# EAGLE design EFR732 (EAGLE 9.0.0)
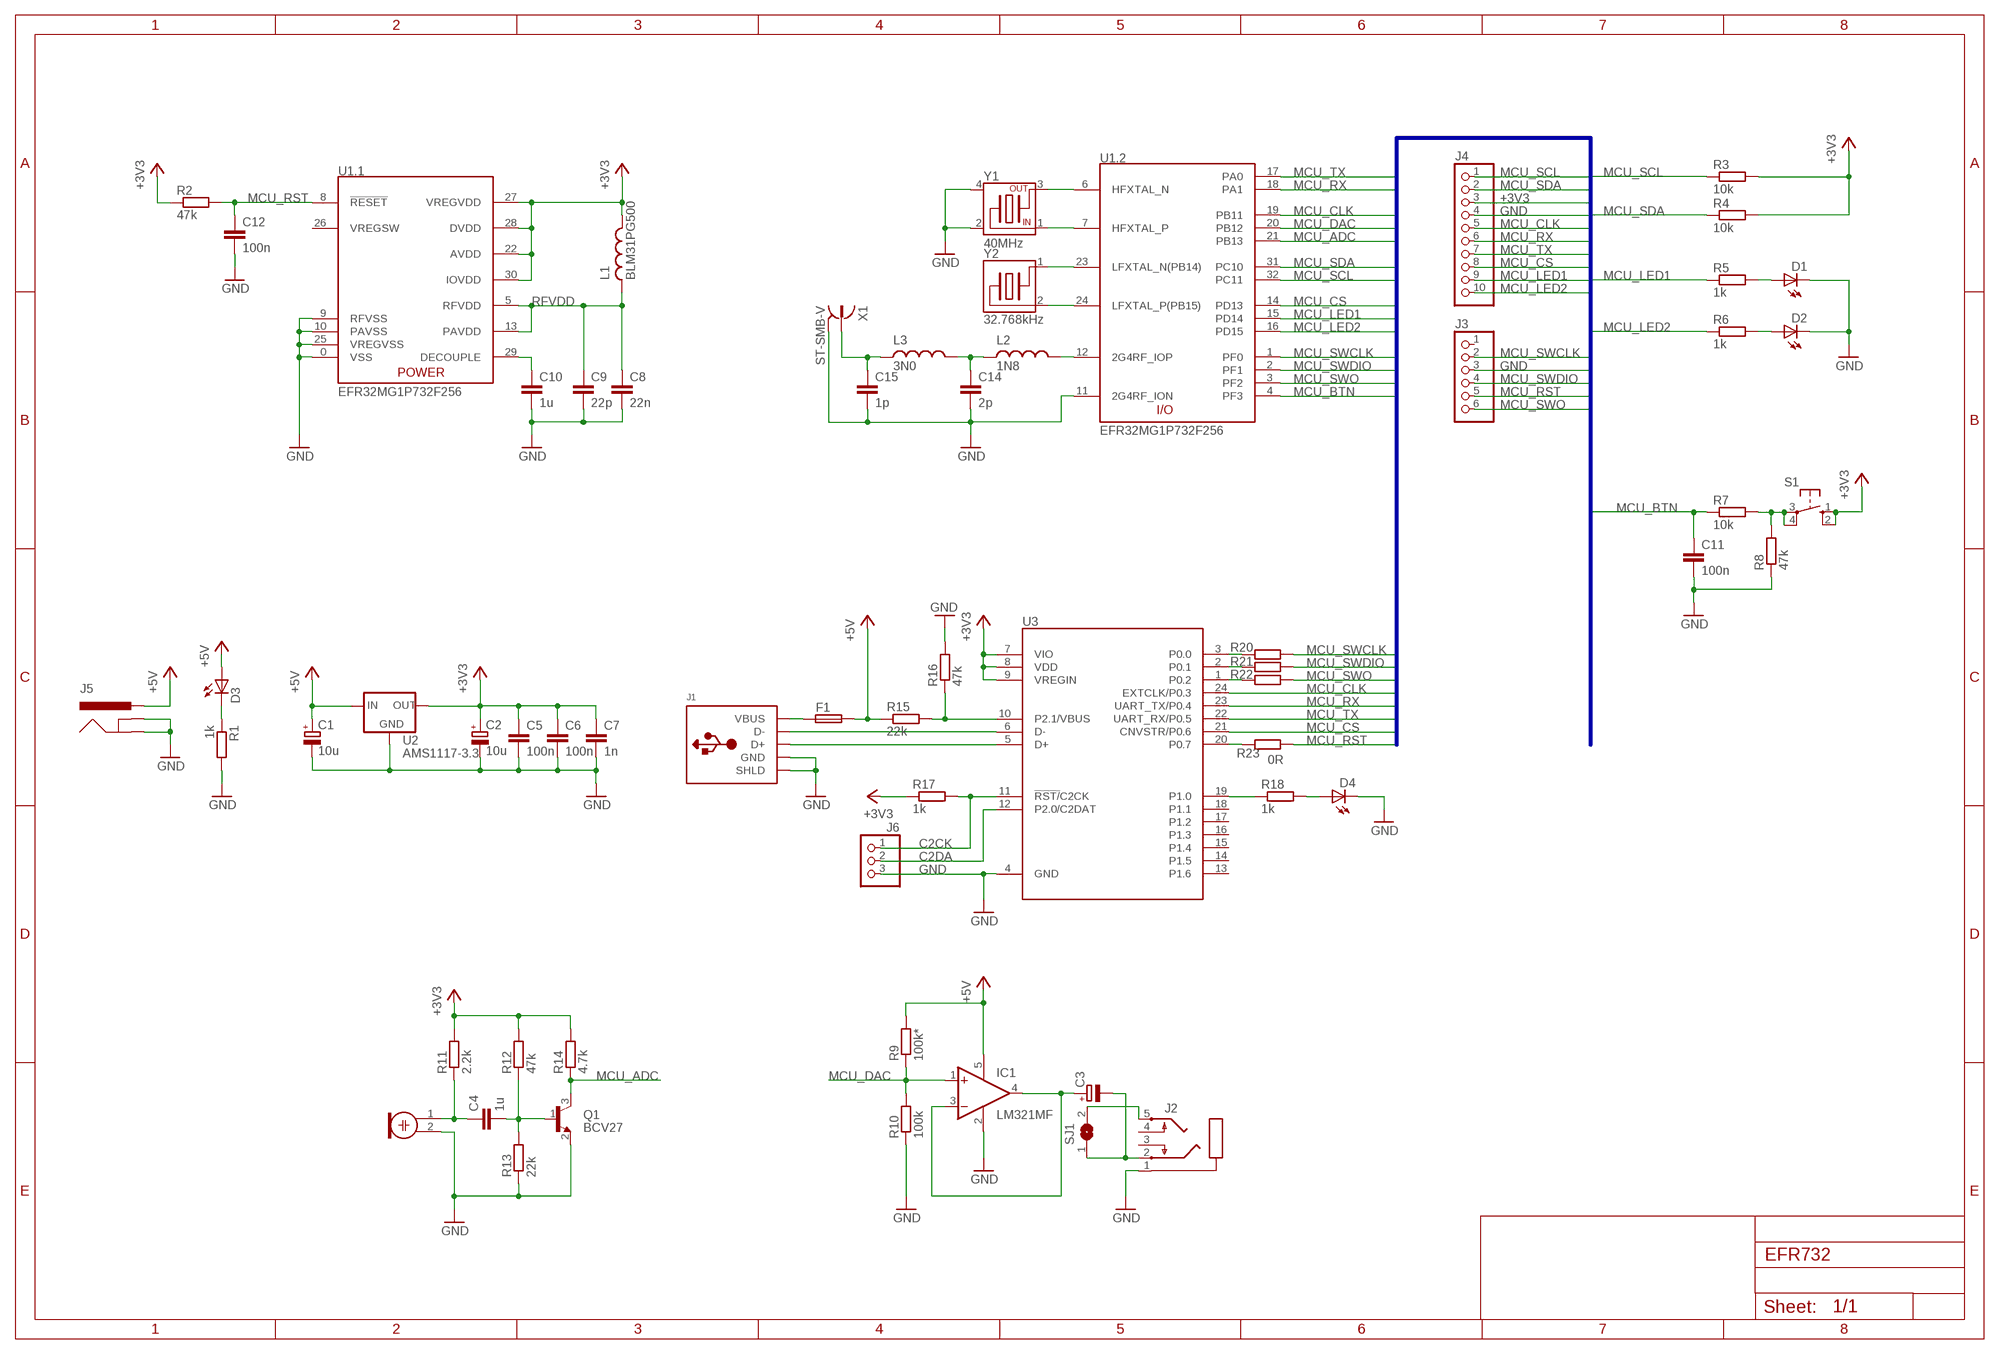
[diagram p0: schematic, sheet 1]

## Parts
C1  10u  CPOL-EU  [RCL-1206F-POL]
C2  10u  CPOL-EU  [RCL-1206F-POL]
C3  CPOL-EU  [RCL-1206F-POL]
C4  1u  C-EU1206  [RCL-1206F]
C5  100n  C-EU0805  [RCL-0805F]
C6  100n  C-EU0805  [RCL-0805F]
C7  1n  C-EU0805  [RCL-0805F]
C8  22n  C-EU0805  [RCL-0805F]
C9  22p  C-EU0805  [RCL-0805F]
C10  1u  C-EU1206  [RCL-1206F]
C11  100n  C-EU0805  [RCL-0805F]
C12  100n  C-EU0805  [RCL-0805F]
C14  2p  C-EU0805  [RCL-0805F]
C15  1p  C-EU0805  [RCL-0805F]
D1  LED1206  [LED-1206F]
D2  LED1206  [LED-1206F]
D3  LED1206  [LED-1206F]
D4  LED1206  [LED-1206F]
F1  FUSE-NSMF  [RCL-1206F]
IC1  LM321MF  [SOT23-5]
J1  USB-TYPE-B  [USB-TYPE-B-4P]
J2  AUDIO-JACK-3.5MM  [AUDIO-PG203J]
J3  PINH-1X06  [PINH-1X06]
J4  PINH-1X10  [PINH-1X10]
J5  POWER_JACK  [POWER_JACK_PTH]
J6  PINHD-1X3  [1X03]
L1  BLM31PG500  L-EU1206  [RCL-1206F]
L2  1N8  L-EU  [RCL-0603F]
L3  3N0  L-EU  [RCL-0603F]
M1  ELECTRET_MICROPHON-WM-62PC/62PK  [WM-62PC/62PK]
Q1  BCV27  TR-NPN  [SOT23]
R1  1k  R-EU0805  [RCL-0805F]
R2  47k  R-EU0805  [RCL-0805F]
R3  10k  R-EU0805  [RCL-0805F]
R4  10k  R-EU0805  [RCL-0805F]
R5  1k  R-EU0805  [RCL-0805F]
R6  1k  R-EU0805  [RCL-0805F]
R7  10k  R-EU0805  [RCL-0805F]
R8  47k  R-EU0805  [RCL-0805F]
R9  100k*  R-EU0805  [RCL-0805F]
R10  100k  R-EU0805  [RCL-0805F]
R11  2.2k  R-EU0805  [RCL-0805F]
R12  47k  R-EU0805  [RCL-0805F]
R13  22k  R-EU0805  [RCL-0805F]
R14  4.7k  R-EU0805  [RCL-0805F]
R15  22k  R-EU0805  [RCL-0805F]
R16  47k  R-EU0805  [RCL-0805F]
R17  1k  R-EU0805  [RCL-0805F]
R18  1k  R-EU0805  [RCL-0805F]
R20  R-EU0805  [RCL-0805F]
R21  R-EU0805  [RCL-0805F]
R22  R-EU0805  [RCL-0805F]
R23  0R  R-EU0805  [RCL-0805F]
S1  SWITCH-10-XX  [BUTTON-B3F-10XX]
SJ1  SJ  [SJ]
U1  EFR32MG1P732F256  EFR32MG1P732-QFN32  [QFN32_5X5MM_EFR32MG1]
U2  AMS1117-3.3  [SOT223]
U3  EFM8UB31F40G-QSOP24  [QSOP24-3.9X8.65MM]
X1  ST-SMB-V  [ST-SMB-V]
Y1  40MHz  CRYSTAL-FA-238R  [XTAL-FA-238]
Y2  32.768kHz  CRYSTAL-FC-135R  [XTAL-FC-135]

## Nets
+3V3: C2.+ C5.1 C6.1 C7.1 J4.3 L1.2 R2.1 R3.2 R4.2 R11.2 R12.2 R14.2 R17.1 S1.1(S) S1.2(S1) U1.22(.1:AVDD) U1.27(.1:VREGVDD) U1.28(.1:DVDD) U1.30(.1:IOVDD) U2.2(OUT) U2.4(OUT) U3.7(VIO) U3.8(VDD) U3.9(VREGIN)
+5V: C1.+ D3.A F1.2 IC1.5(V+) J5.PWR R9.2 R15.1 U2.3(IN)
C2CK: J6.1 R17.2 U3.11(!RST/!C2CK)
C2DA: J6.2 U3.12(P2.0/C2DAT)
GND: C1.- C2.- C5.2 C6.2 C7.2 C8.2 C9.2 C10.2 C11.2 C12.2 C14.2 C15.2 D1.C D2.C D4.C IC1.2(V-) J1.4_GND(GND) J1.M1(SHLD) J1.M2(SHLD) J2.1 J3.3 J4.4 J5.GND J5.GNDBREAK J6.3 M1.2 Q1.2(E) R1.2 R8.1 R10.1 R13.1 R16.2 U1.0(.1:VSS) U1.9(.1:RFVSS) U1.10(.1:PAVSS) U1.11(.2:2G4RF_ION) U1.25(.1:VREGVSS) U2.1(GND) U3.4(GND) X1.2 X1.3 X1.4 X1.5 Y1.2 Y1.4
MCU_ADC: Q1.3(C) R14.1 U1.21(.2:PB13)
MCU_BTN: C11.1 R7.1 U1.4(.2:PF3)
MCU_CLK: J4.5 U1.19(.2:PB11) U3.24(EXTCLK/P0.3)
MCU_CS: J4.8 U1.14(.2:PD13) U3.21(CNVSTR/P0.6)
MCU_DAC: IC1.1(+IN) R9.1 R10.2 U1.20(.2:PB12)
MCU_LED1: J4.9 R5.1 U1.15(.2:PD14)
MCU_LED2: J4.10 R6.1 U1.16(.2:PD15)
MCU_RST: C12.1 J3.5 R2.2 R23.2 U1.8(.1:!RESET)
MCU_RX: J4.6 U1.18(.2:PA1) U3.23(UART_TX/P0.4)
MCU_SCL: J4.1 R3.1 U1.32(.2:PC11)
MCU_SDA: J4.2 R4.1 U1.31(.2:PC10)
MCU_SWCLK: J3.2 R20.2 U1.1(.2:PF0)
MCU_SWDIO: J3.4 R21.2 U1.2(.2:PF1)
MCU_SWO: J3.6 R22.2 U1.3(.2:PF2)
MCU_TX: J4.7 U1.17(.2:PA0) U3.22(UART_RX/P0.5)
N$1: U1.23(.2:LFXTAL_N(PB14)) Y2.1(1.XIN)
N$2: U1.24(.2:LFXTAL_P(PB15)) Y2.2(2.XIN)
N$3: U1.7(.2:HFXTAL_P) Y1.1(X.IN)
N$4: U1.6(.2:HFXTAL_N) Y1.3(X.OUT)
N$5: F1.1 J1.1_VBUS(VBUS)
N$6: C14.1 L2.1 L3.2
N$7: R20.1 U3.3(P0.0)
N$8: C15.1 L3.1 X1.1
N$9: D3.C R1.1
N$10: D1.A R5.2
N$11: C10.1 U1.29(.1:DECOUPLE)
N$12: D2.A R6.2
N$13: C3.+ IC1.3(-IN) IC1.4(OUT)
N$14: J2.5 SJ1.2
N$15: R7.2 R8.2 S1.3(P) S1.4(P1)
N$16: J1.2_DM(D-) U3.6(D-)
N$17: J1.3_DP(D+) U3.5(D+)
N$18: R21.1 U3.2(P0.1)
N$19: R15.2 R16.1 U3.10(P2.1/VBUS)
N$20: C4.1 M1.1 R11.1
N$21: C3.- J2.2 SJ1.1
N$22: C4.2 Q1.1(B) R12.1 R13.2
N$23: R22.1 U3.1(P0.2)
N$24: R18.1 U3.19(P1.0)
N$25: D4.A R18.2
N$26: R23.1 U3.20(P0.7)
RF_IOP: L2.2 U1.12(.2:2G4RF_IOP)
RFVDD: C8.1 C9.1 L1.1 U1.5(.1:RFVDD) U1.13(.1:PAVDD)
Unconnected: J2.3 J2.4 J3.1 U3.13(P1.6) U3.14(P1.5) U3.15(P1.4) U3.16(P1.3) U3.17(P1.2) U3.18(P1.1)

## Buses
+3V3,GND,MCU_ADC,MCU_BTN,MCU_CLK,MCU_CS,MCU_DAC,MCU_LED1,MCU_LED2,MCU_RST,MCU_RX,MCU_SCL,MCU_SDA,MCU_SWCLK,MCU_SWDIO,MCU_SWO,MCU_TX

## Power pins joined to a net without a drawn wire
VREGSW: U1.26(.1:VREGSW)

## Library data of the parts
C1-C3 = MakBit:CPOL-EU: Polarized capacitor Tantalum SMD 3215, Electrolytic D: 5mm (10uF 50V), 6mm (100uF 9V), 7mm, 10mm (10uF 400V), 13mm (22uF 400V)
C4-C12 C14 C15 = MakBit:C-EU: SMD Capacitor
D1-D4 = MakBit:LED: LEDs Standard schematic elements and footprints for 5mm, 3mm, 1206 LEDs.
F1 = MakBit:FUSE-NSMF: Bourns MF-NSMF Series - PRC Resettable Fuses USB port protection - USB 2.0, 3.0 HDMI 1.4 Source protection PC motherboards - Plug and Play protection Mobile phones - Battery and port protection PDAs / digital cameras
IC1 = linear:LM321?*: Low Power Single Op Amp Source: http://cache.national.com/ds/LM/LM321.pdf
J1 = MakBit:USB-TYPE-B: USB Type-B Connector 4 Pins
J2 = MakBit:AUDIO-JACK-3.5MM: Audio Jack 3.5 mm (Stereo) Also known as: PG203J or ST-214N
J3 = MakBit:PINH-1X06
J4 = MakBit:PINH-1X10
J5 = MakBit:POWER_JACK: Power Jack DC For 5.5mm x 2.1mm connector. DS-210A, DCJ0202
J6 = pinhead:PINHD-1X3: PIN HEADER
L1-L3 = MakBit:L-EU: Inductor SMD 0603 0805 1206 Through hole 9 x 12 mm
M1 = microphon:ELECTRET_MICROPHON-: Electret Condenser Microphone
Q1 = MakBit:TR-NPN: Bipolar NPN transistor MMBT4401 SOT23 BC548 TO-92 MJE13007 TO-220
R1-R18 R20-R23 = MakBit:R-EU: SMD & Through-hole Resistor
S1 = MakBit:SWITCH-10-XX: OMRON SWITCH; MPN: B3F-1000; OC_FARNELL: 176432; OC_NEWARK: 36M3542
SJ1 = jumper:SJ: SMD solder JUMPER
U1 = MakBit:EFR32MG1P732-QFN32: EFR32MG1P732 Mighty Gecko SoC with Integrated Serial Flash This 5x5 QFN32 package is ideal for space constrained products that need to support ZigBee, Thread, BLE and proprietary networks. Integrates a 512 kB serial flash in the package to support over the air updates. High Performance 32-bit 40 MHz ARM Cortex®-M4 32 kB RAM, 256 kB flash program memory 2.4 GHz radio operation, TX power up to 19.5 dBm Bluetooth Smart, ZigBee®, Thread, 2.4 GHz Proprietary Protocols 12-bit ADC, iDAC, 16 GPIO, 12 channel PRS, USART/SPI/IrDA, I2C 2.3 to 3.6 V operation, 200 mA QFN32 5x5 mm Package
U2 = MakBit:AMS1117-3.3: 1A Low Dropout Voltage Regulator
U3 = silabs-mcu:EFM8UB31F40G-QSOP24: EFM8UB3 is a multi-purpose line of 8-bit microcontrollers with USB feature set insmall packages. <https://www.silabs.com/documents/public/data-sheets/efm8ub3-datasheet.pdf> CPU: 8051 48 MHz, 40 kB Flash, 3328 Bytes RAM Communication: UART, I2C, SPI, 12-bit ADC, 12-bit DAC, 3 PCA/PWM, 6 Timers, 17 I/O ports, 16-bit CRC Package: QSOP24 8.7x3.9 mm
X1 = con-coax:ST-SMB-V: MALE SMB CONNECTOR Radiall distributor RS 193-8855G7; OC_FARNELL: unknown; OC_NEWARK: unknown
Y1 = MakBit:CRYSTAL-FA-238R: FA-238 Crystal Unit Frequency range: 12 MHz to 60 MHz 3.2 x 2.5 mm
Y2 = MakBit:CRYSTAL-FC-135R

## Board
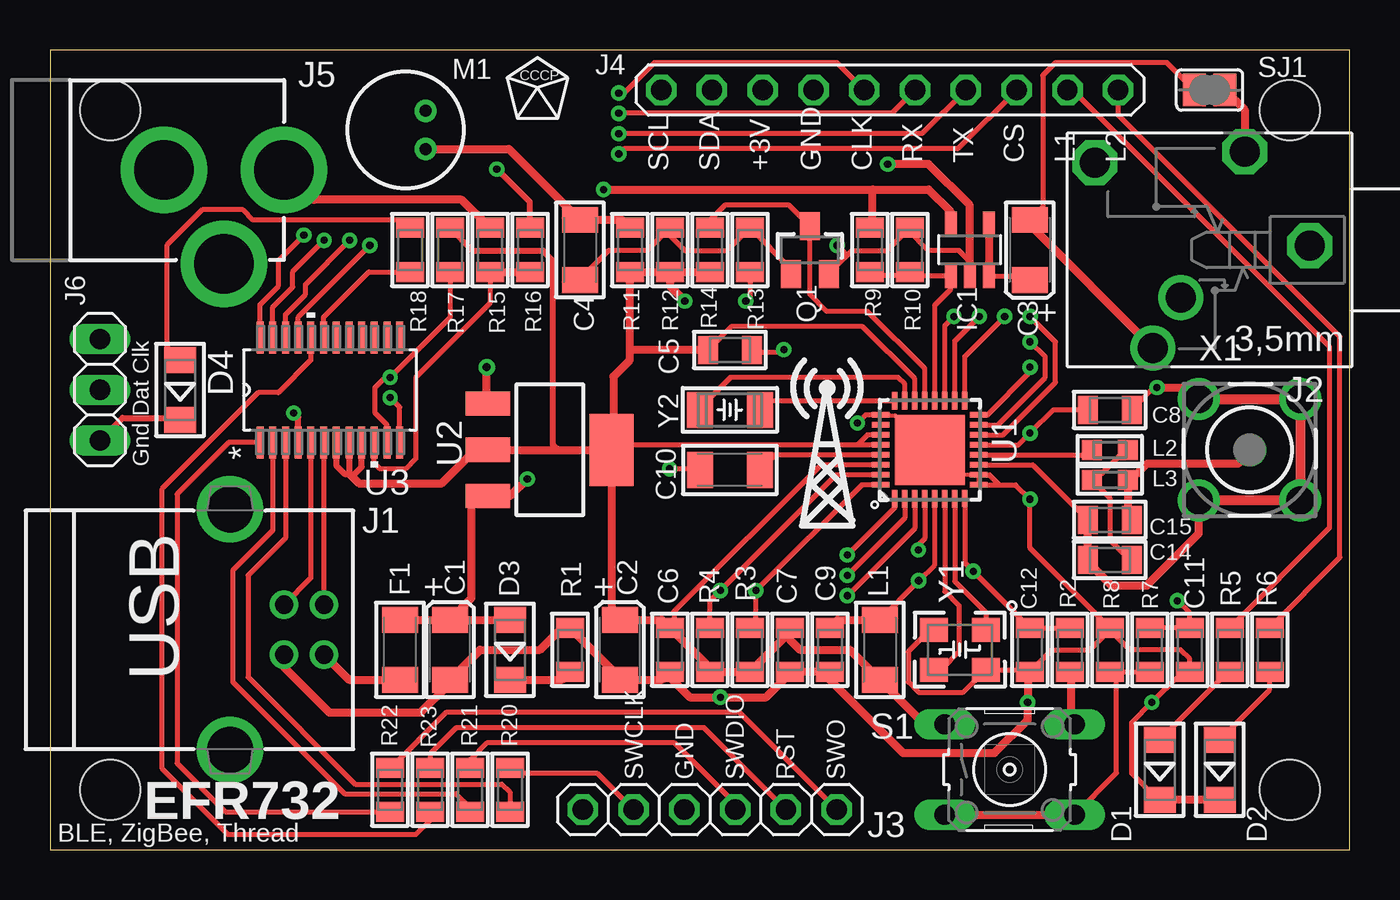
[diagram p1: board, top side]
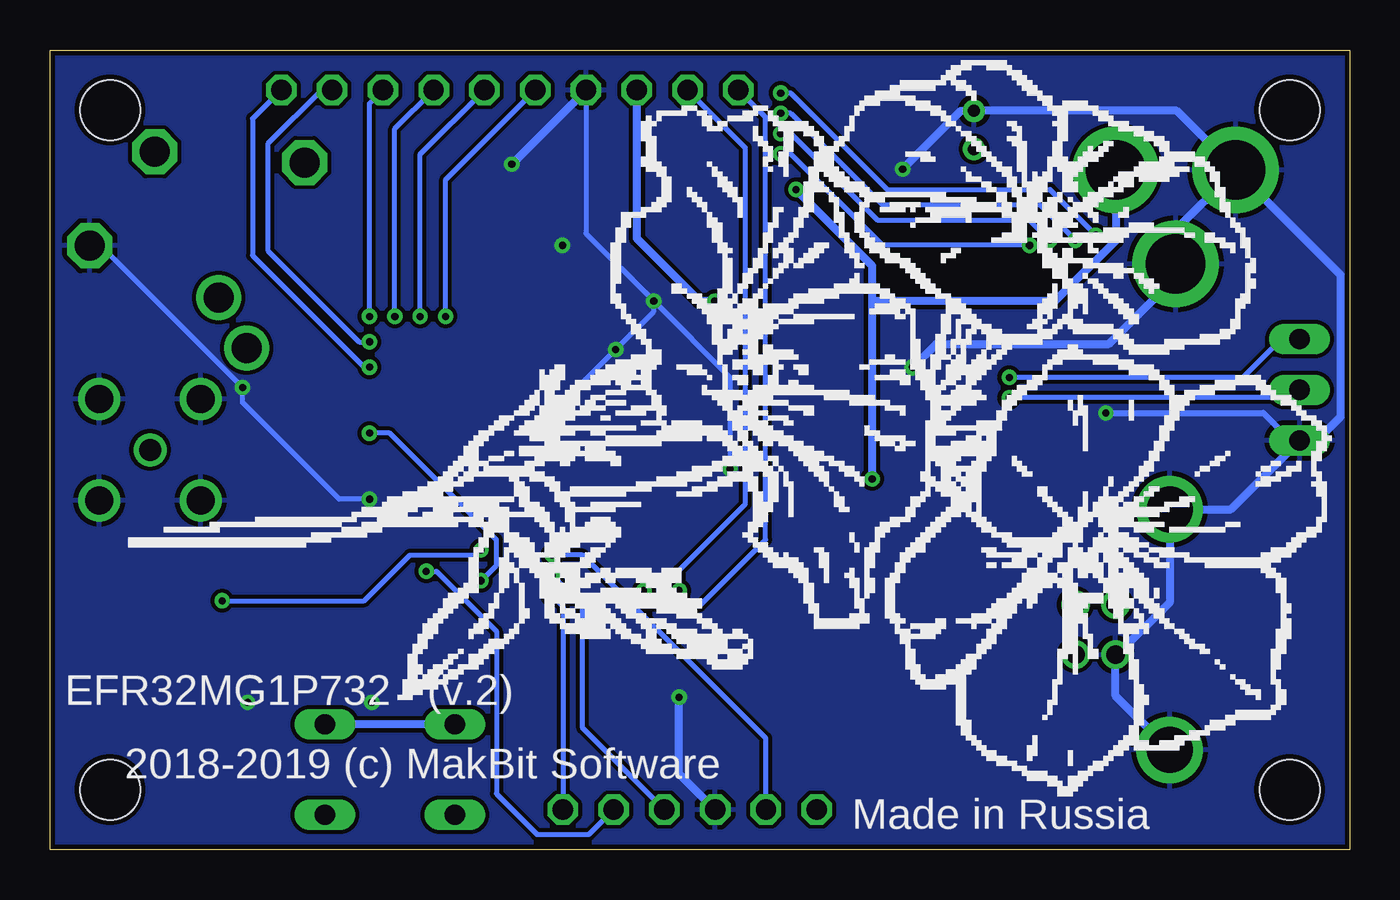
[diagram p2: board, bottom side, seen from below]

Size 65 x 40 mm. Coordinates in mm from the lower left corner, seen from the top.
Outline: 0,0 65,0 65,40 0,40 0,0
Copper layers (1*16): Top 0.035mm / dielectric 1.5mm / Bottom 0.035mm
Design rules "default *": minimum track width 10mil, minimum drill 14mil, track to track 8mil, track to pad 8mil, pad to pad 8mil, via to via 8mil, smd to smd 8mil, copper to edge 10mil, drill to drill 8mil, minimum pad ring 10mil, minimum via ring 8mil, stop-mask expansion 4mil, vias tented up to drill 16mil, thermal gap 10mil
Holes 3 mm at 3,3 3,37 62,37 62,3

### Footprints (pad centres in the part's own frame; a part is rotated, then mirrored left to right if it is on the bottom)
RCL-1206F-POL = smd 1.3 x 1.8: + 1.5,0; - -1.5,0
RCL-1206F = smd 1.3 x 1.8: 1 -1.5,0; 2 1.5,0
RCL-0805F = smd 1 x 1.4: 1 -1.1,0; 2 1.1,0
LED-1206F = smd 1.3 x 1.6: A -1.5,0; C 1.5,0
SOT23-5 = smd 0.6 x 1.2: 1 -0.95,-1.306; 2 0,-1.306; 3 0.95,-1.306; 4 0.95,1.306; 5 -0.95,1.306
USB-TYPE-B-4P = drill 0.92 pad 1.27: 1_VBUS 4.71,-1.25; 2_DM 4.71,1.25; 3_DP 2.71,1.25; 4_GND 2.71,-1.25 | drill 2.3 pad 3: M1 0,6.02; M2 0,-6.02
AUDIO-PG203J = drill 1.499 octagon: 1 -5.004,-0.203; 4 5.74,-4.369; 5 -1.753,-4.902 | drill 1.499: 2 2.845,4.902; 3 1.448,2.388
PINH-1X06 = drill 1.016 octagon: 1 -6.35,0; 2 -3.81,0; 3 -1.27,0; 4 1.27,0; 5 3.81,0; 6 6.35,0
PINH-1X10 = drill 1.016 octagon: 1 -11.43,0; 2 -8.89,0; 3 -6.35,0; 4 -3.81,0; 5 -1.27,0; 6 1.27,0; 7 3.81,0; 8 6.35,0; 9 8.89,0; 10 11.43,0
POWER_JACK_PTH = drill 2.997 pad 4.318: GND 0,7.7; GNDBREAK 4.7,10.7; PWR 0,13.7
1X03 = drill 1.016 long: 1 -2.54,0; 2 0,0; 3 2.54,0
RCL-0603F = smd 1 x 1: 1 -0.9,0; 2 0.9,0
WM-62PC/62PK = drill 0.6 pad 1: 1 -1,0.95; 2 -1,-0.95
SOT23 = smd 1 x 1.4: 1 -0.95,-1.2; 2 0.95,-1.2; 3 0,1.2
BUTTON-B3F-10XX = drill 1.016 long: 1 -3.251,2.261; 2 3.251,2.261; 3 -3.251,-2.261; 4 3.251,-2.261
SJ = smd 1.168 x 1.6: 1 -0.762,0; 2 0.762,0
QFN32_5X5MM_EFR32MG1 = smd 3.5 x 3.5: 0 0,0 | smd 0.86 x 0.26: 1 -2.45,1.75; 2 -2.45,1.25; 3 -2.45,0.75; 4 -2.45,0.25; 5 -2.45,-0.25; 6 -2.45,-0.75; 7 -2.45,-1.25; 8 -2.44,-1.75; 17 2.45,-1.75; 18 2.45,-1.25; 19 2.45,-0.75; 20 2.45,-0.25; 21 2.45,0.25; 22 2.45,0.75; 23 2.45,1.25; 24 2.45,1.75 | smd 0.26 x 0.86: 9 -1.75,-2.45; 10 -1.25,-2.45; 11 -0.75,-2.45; 12 -0.25,-2.45; 13 0.25,-2.45; 14 0.75,-2.45; 15 1.25,-2.45; 16 1.75,-2.45; 25 1.75,2.45; 26 1.25,2.45; 27 0.75,2.45; 28 0.25,2.45; 29 -0.25,2.45; 30 -0.75,2.45; 31 -1.25,2.45; 32 -1.75,2.45
SOT223 = smd 1.219 x 2.235: 1 -2.311,-3.099; 2 0,-3.099; 3 2.311,-3.099 | smd 3.6 x 2.2: 4 0,3.099
QSOP24-3.9X8.65MM = smd 1.6 x 0.35: 1 -2.625,3.493; 2 -2.625,2.857; 3 -2.625,2.223; 4 -2.625,1.587; 5 -2.625,0.953; 6 -2.625,0.318; 7 -2.625,-0.318; 8 -2.625,-0.953; 9 -2.625,-1.587; 10 -2.625,-2.223; 11 -2.625,-2.857; 12 -2.625,-3.493; 13 2.625,-3.493; 14 2.625,-2.857; 15 2.625,-2.223; 16 2.625,-1.587; 17 2.625,-0.953; 18 2.625,-0.318; 19 2.625,0.318; 20 2.625,0.953; 21 2.625,1.587; 22 2.625,2.223; 23 2.625,2.857; 24 2.625,3.493
ST-SMB-V = drill 1.1: 1 0,0 | drill 1.4: 2 -2.54,2.54; 3 2.54,2.54; 4 2.54,-2.54; 5 -2.54,-2.54
XTAL-FA-238 = smd 1.4 x 1.2: 1 -1.3,-1; 2 1.3,-1; 3 1.3,1; 4 -1.3,1
XTAL-FC-135 = smd 1.3 x 1.8: 1 -1.5,0; 2 1.5,0

### Placement (x,y rotation side)
C1  20,10 90 top
C2  28.5,10 90 top
C3  49,30 270 top
C4  26.5,30 270 top
C5  34,25 0 top
C6  31,10 270 top
C7  37,10 270 top
C8  53,22 0 top
C9  39,10 270 top
C10  34,19 180 top
C11  57,10 270 top
C12  49,10 270 top
C14  53,14.5 180 top
C15  53,16.5 180 top
D1  55.5,4 270 top
D2  58.5,4 270 top
D3  23,10 270 top
D4  6.5,23 270 top
F1  17.5,10 90 top
IC1  46,30 0 top
J1  9,11 0 top
J2  58,30 180 top
J3  33,2 0 top
J4  42,38 0 top
J5  -2,34 270 top
J6  2.5,23 270 top
L1  41.5,10 270 top
L2  53,20 180 top
L3  53,18.5 180 top
M1  17.78,36 180 top
Q1  38,30 0 top
R1  26,10 90 top
R2  51,10 90 top
R3  35,10 270 top
R4  33,10 270 top
R5  59,10 270 top
R6  61,10 270 top
R7  55,10 270 top
R8  53,10 270 top
R9  41,30 90 top
R10  43,30 270 top
R11  29,30 270 top
R12  31,30 270 top
R13  35,30 90 top
R14  33,30 270 top
R15  22,30 270 top
R16  24,30 90 top
R17  20,30 270 top
R18  18,30 90 top
R20  23,3 90 top
R21  21,3 90 top
R22  17,3 90 top
R23  19,3 90 top
S1  48,4 0 top
SJ1  58,38 0 top
U1  44,20 90 top
U2  25,20 270 top
U3  14,23 90 top
X1  60,20 0 top
Y1  45.5,10 180 top
Y2  34,22 0 top

### Tracks (layer width: path | path; a pad name or v marks a point on that pad's centre or on a via)
+3V3  (via drill 0.36)
  Top 0.254: U1.28 40.39,20.25 | 40.39,20.25 28.35,20.25 28.18,20.08 U2.4 | U1.27 40.89,20.75 40.39,20.25 | 31.21,10.89 31.21,11.91 38.55,19.25 U1.30 | U1.22 43.25,23.55 40.64,26.16 34.06,26.16 C5.1
  Top 0.305: R17.1 21.13,29.97 24.64,29.97 25.15,29.46 25.15,20.25 25.4,20 | U3.7 14.32,19.21 14.73,18.8 14.99,18.8 | 14.99,18.8 15.24,18.8 15.59,19.14 U3.9 | U3.8 14.95,18.83 14.99,18.8
  Top 0.406: S1.2 51.05,6.26 51.05,8.85 R2.1 | S1.1 43.74,6.26 L1.2 40,10 37.5,10 37,10.5 C7.1 37,10.9 R3.2 R4.2 33,9.1 31.21,10.89 C6.1 30.6,11.5 C2.+ 28.1,11.9 U2.4 25.4,20 U2.2 | 28.18,20.08 28.18,23.67 29,24.49 29,24.89 | 29,24.89 R11.2 R12.2 | R12.2 R14.2 | C5.1 29.11,25 29,24.89 | R12.2 31,28.18 v31.75,27.43 | U2.2 21.51,19.61 | U2.2 21.27,20 19.56,18.29 15.49,18.29 14.99,18.8
  Bottom 0.406: S1.1 S1.2 | v31.75,27.43 32.51,27.43 35.65,30.57 J4.3
+5V  (via drill 0.36)
  Top 0.254: 40.89,31.21 R9.2
  Top 0.406: C1.+ D3.A | C1.+ 21.08,12.58 21.08,17.53 21.25,17.69 U2.3 | U2.3 21.17,17.69 | v27.69,33.02 41.15,33.02 | 41.15,33.02 43.94,33.02 45.05,31.91 IC1.5 | R9.2 41.15,31.25 41.15,33.02 | F1.2 C1.+ | v23.88,18.54 23.02,17.69 U2.3 | R15.1 20.59,32.51 13.19,32.51 J5.PWR
  Bottom 0.406: v27.69,33.02 23.88,29.21 23.88,27.43 | 23.88,27.43 v23.88,18.54 | J5.PWR 11.7,30.46 14.73,27.43 23.88,27.43
C2CK  (via drill 0.36)
  Top 0.254: R17.2 20,26.6 v17.02,23.62 16.76,23.62 16.26,23.11 16.26,21.84 16.86,21.24 U3.11
  Bottom 0.254: 2.91,25.54 J6.1 3.42,25.54 5.33,23.62 v17.02,23.62
C2DA  (via drill 0.36)
  Top 0.254: v17.02,22.61 17.49,22.13 U3.12
  Bottom 0.254: J6.2 2.89,22.61 v17.02,22.61
GND  (via drill 0.36, 0.41)
  Top 0.203: U1.25 41.96,21.75 41.99,21.71 42.28,21.71 U1.0 45.25,18.75 U1.10 U1.9
  Top 0.254: 53,11 52,10 50.1,10 C12.2 48.9,9 Y1.4 45.67,7.87 43.43,7.87 42.93,8.38 42.93,9.91 44.02,11 Y1.2 | 53,11 R8.1 49.02,15.08 v49.02,17.53 48.3,18.25 47.5,18.25 | 53,11 54,10 56.55,10 57,9.55 C11.2 56.65,8.9 56.03,8.28 56.03,8.26 55.84,8.07 55.82,8.07 v55.12,7.37 54.1,6.35 54.1,3.81 55.41,2.5 D1.C | Q1.2 39.75,29.6 | 39.75,29.6 40.12,29.97 41.87,29.97 42.91,31.01 | 42.91,31.01 R10.1 | IC1.2 45.97,28.72 45.97,29.46 45.47,29.97 43.94,29.97 42.91,31.01 | U1.25 40.8,21.75 v40.39,21.34 | C10.2 32.45,19.05 v30.99,19.05 | R13.1 35,27.63 v34.8,27.43 | C5.2 35.21,24.89 36.58,24.89 v36.7,25.02 | C8.2 55.21,23.11 v55.37,23.11 | U1.9 47.5,18.25 | 48.9,7.62 v48.9,7.37 | U1.10 47,18.75 47.5,18.25 | U1.11 49.15,19.25 C15.2 | 39.75,29.6 39.75,29.85 v39.37,30.23
  Top 0.305: R16.2 24,32.39 v22.35,34.04 | 6.84,21.84 6.6,21.6 | 6.6,21.6 D4.C | J6.3 3.64,21.6 6.6,21.6 | U3.4 12.41,21.62 v12.19,21.84
  Top 0.406: 37.08,8.9 C9.2 39,8.5 42.67,4.83 47.24,4.83 48.9,6.48 v48.9,7.37 | 37.08,8.9 C7.2 | 37.08,8.9 37.08,8.89 35.81,7.62 v33.53,7.62 32,7.62 31,8.62 C6.2 30.6,8.5 C2.- 28.5,8.6 R1.2 25.6,11.1 24.5,10 21.5,10 C1.- 20,8.32 18.54,6.86 13.97,6.86 11.71,9.12 J1.4_GND | U2.1 21.84,22.37 v21.84,24.13 | 48.9,9 48.9,7.62 | D2.C D1.C | IC1.2 46,32.23 43.94,34.29 v41.9,34.29 | X1.5 57.46,15.8 54.86,13.21 53.09,13.21 51.9,14.39 C14.2 C15.2 | v55.37,23.11 56.89,23.11 X1.2
  Top 0.508: X1.2 X1.3 X1.4 X1.5
  Bottom 0.254: v34.8,27.43 30.99,23.62 v30.99,19.05 | v40.39,21.34 v36.7,25.02 34.8,26.92 v34.8,27.43 | J2.1 62.46,30.2 v55.37,23.11 55.37,22.35 50.55,17.53 v49.02,17.53 | J4.4 38.19,30.82 v34.8,27.43 | J5.GNDBREAK 8.73,29.3 8.89,29.46
  Bottom 0.305: v12.19,21.84 4.32,21.84 2.72,20.24
  Bottom 0.406: v21.84,24.13 20.67,25.3 12.04,25.3 8.89,28.45 8.89,29.46 8.89,30.81 J5.GND | J1.M2 11.71,7.69 11.71,9.65 | 11.71,9.65 J1.4_GND | 11.71,9.65 9,12.36 J1.M1 5.94,17.02 2.72,20.24 J6.3 1.92,20.46 1.78,20.32 0.46,21.64 0.46,28.76 J5.GND | J4.4 v41.9,34.29 | J5.GND 8.65,36.95 M1.2 19.44,36.95 v22.35,34.04 | J3.3 33.53,3.8 v33.53,7.62
  pour Bottom: 0.02,39.88 0.02,0 65.02,0 65.02,39.88
MCU_ADC
  Top 0.254: R14.1 33,31.48 33.78,32.26 36.94,32.26 Q1.3 38,27.79 38.86,26.92 40.89,26.92 43.75,24.07 U1.21
MCU_BTN  (via drill 0.36)
  Top 0.254: R7.1 C11.1 57,11.83 v56.39,12.45 | v43.43,14.99 43.43,15.24 43.75,15.56 U1.4
  Bottom 0.254: v56.39,12.45 49.28,12.45 46.99,14.73 43.69,14.73 v43.43,14.99
MCU_CLK  (via drill 0.36)
  Top 0.254: U1.19 44.75,26.21 v45.21,26.67 | J4.5 39.36,39.37 30.23,39.37 28.7,37.85 v28.45,37.85 | U3.24 10.51,27.27 11.43,28.19 11.43,29.46 v12.7,30.73
  Bottom 0.254: v45.21,26.67 45.21,33.52 J4.5 | v28.45,37.85 27.94,37.85 23.11,33.02 14.99,33.02 v12.7,30.73
MCU_CS  (via drill 0.36)
  Top 0.254: U1.14 47.67,20.75 50.29,23.37 50.29,25.4 v49.02,26.67 | v28.45,34.8 28.7,35.05 45.4,35.05 J4.8 | U3.21 12.41,26.64 v16,30.23
  Bottom 0.254: v49.02,26.67 49.02,37.33 J4.8 | v16,30.23 23.37,30.23 27.94,34.8 v28.45,34.8
MCU_DAC
  Top 0.254: R9.1 41.2,28.7 42.8,28.7 R10.2 43.21,28.69 IC1.1 45.05,28.03 44.25,27.23 U1.20
MCU_LED1  (via drill 0.36)
  Top 0.254: R5.1 64.01,16.11 64.01,25.15 51.15,38 J4.9 | v49.02,25.4 49.78,24.64 49.78,23.62 47.41,21.25 U1.15
  Bottom 0.254: J4.9 51.41,38 54.1,35.31 54.1,29.97 49.53,25.4 v49.02,25.4
MCU_LED2  (via drill 0.36)
  Top 0.254: U1.16 46.9,21.75 49.02,23.88 v49.02,24.13 | R6.1 64.52,14.62 64.52,25.65 53.43,36.74 J4.10
  Bottom 0.254: J4.10 54.86,36.57 54.86,29.72 49.28,24.13 v49.02,24.13
MCU_RST  (via drill 0.36)
  Top 0.254: U1.8 45.75,14.35 v46.18,13.92 C12.1 R2.2 | J3.5 32.71,6.1 20.32,6.1 19,4.78 R23.2
  Bottom 0.254: v46.18,13.92 45.67,13.92 42.67,10.92 42.67,2.79 40.64,0.76 38.05,0.76 J3.5
MCU_RX  (via drill 0.36)
  Top 0.254: U1.18 45.25,25.44 v46.48,26.67 | J4.6 42.1,36.83 v28.45,36.83 | v13.72,30.48 12.14,28.91 12.14,28.14 11.14,27.14 U3.23
  Bottom 0.254: v46.48,26.67 46.48,34.79 J4.6 | v28.45,36.83 27.94,36.83 23.37,32.26 15.49,32.26 v13.72,30.48
MCU_SCL  (via drill 0.36)
  Top 0.254: U1.32 40.6,18.25 v35.31,12.95 35.31,11.41 R3.1
  Bottom 0.254: J4.1 29.21,36.64 29.21,15.49 32.51,12.19 34.54,12.19 v35.31,12.95
MCU_SDA  (via drill 0.36)
  Top 0.254: R4.1 33,12.43 v33.53,12.95 39.32,18.75 U1.31
  Bottom 0.254: J4.2 30.23,35.12 30.23,17.27 33.53,13.97 v33.53,12.95
MCU_SWCLK  (via drill 0.36)
  Top 0.254: U1.1 42.25,17.1 v39.88,14.73 | J3.2 27.38,3.81 23.05,3.81 R20.2
  Bottom 0.254: v39.88,14.73 38.35,14.73 29.19,5.57 J3.2
MCU_SWDIO  (via drill 0.36)
  Top 0.254: v39.88,13.72 42.75,16.59 U1.2 | J3.4 34.27,2.31 31.24,5.33 21.84,5.33 21,4.49 R21.2
  Bottom 0.254: J3.4 38.35,6.08 38.35,12.19 v39.88,13.72
MCU_SWO  (via drill 0.36)
  Top 0.254: U1.3 43.25,16.07 v39.88,12.7 | J3.6 36.17,5.18 36.02,5.33 34.49,6.86 19.81,6.86 17,4.05 R22.2
  Bottom 0.254: v39.88,12.7 39.35,12.17 J3.6
MCU_TX  (via drill 0.36)
  Top 0.254: U1.17 45.75,24.67 v47.75,26.67 | v28.45,35.81 43.62,35.81 J4.7 | v14.99,30.48 12.78,28.27 12.78,27.76 11.78,26.76 U3.22
  Bottom 0.254: v47.75,26.67 47.75,36.06 J4.7 | v28.45,35.81 27.94,35.81 23.62,31.5 16,31.5 v14.99,30.48
N$1
  Top 0.254: U1.23 42.75,23.29 42.42,23.62 34.04,23.62 32.5,22.09 Y2.1
N$2
  Top 0.254: U1.24 35.95,22.45 Y2.2
N$3
  Top 0.254: U1.7 45.25,13.42 46.8,11.87 Y1.1
N$4
  Top 0.254: U1.6 44.75,12.91 45.47,12.19 45.47,9.91 44.56,9 Y1.3
N$5
  Top 0.406: J1.1_VBUS 14.96,8.5 F1.1
N$6
  Top 0.254: L2.1 53.78,20 52.58,18.8 52.4,18.8 L3.2 53,17.6 53,15.5 54,14.5 C14.1
N$7
  Top 0.254: U3.3 11.78,15.59 9.91,13.72 9.91,8.64 15.27,3.27 22.61,3.27 23,2.88 R20.1
N$8
  Top 0.254: 54.1,18.3 L3.1
  Top 0.406: X1.1 60,19.87 59.44,19.3 54.86,19.3 54.36,18.8 54.2,18.8 L3.1 53.9,16.7 C15.1
N$9
  Top 0.406: D3.C 25.6,8.5 R1.1
N$10
  Top 0.254: D1.A 58.9,8.9 R5.2
N$11
  Top 0.254: U1.29 36.25,19.75 C10.1
N$12
  Top 0.254: D2.A 61,8 R6.2
N$13
  Top 0.254: IC1.3 48.81,28.69 C3.+
  Top 0.406: IC1.4 IC1.3
N$14
  Top 0.406: SJ1.2 59.75,37.01 J2.5
N$15
  Top 0.254: R8.2 53.34,8.9 | 53.34,8.9 R7.2 | S1.4 53.34,3.83 53.34,8.9
  Top 0.406: S1.3 S1.4
N$16
  Top 0.254: U3.6 13.68,12.28 J1.2_DM
N$17
  Top 0.254: U3.5 13.05,13.59 J1.3_DP
N$18
  Top 0.254: U3.2 11.14,15.97 9.14,13.97 9.14,8.38 14.73,2.79 20.32,2.79 21,2.11 R21.1
N$19
  Top 0.254: R15.2 22,27.33 18.29,23.62 18.29,19.56 17.78,19.05 16.51,19.05 16.22,19.34 U3.10
  Top 0.406: R15.2 R16.1
N$20
  Top 0.406: R11.1 28.6,31.5 C4.1 22.95,35.05 M1.1
N$21
  Top 0.254: 49,31.25 C3.- 49.66,32.16 49.66,38.73 50.29,39.37 55.87,39.37 SJ1.1
  Top 0.406: J2.2 49,31.25
N$22
  Top 0.254: Q1.1 37.05,29.05 R13.2 33.87,29.97 31.75,29.97 31,30.72 R12.1 29.87,29.97 27.94,29.97 26.5,28.53 C4.2
N$23
  Top 0.254: U3.1 8.95,20.38 6.35,17.78 6.35,4.32 8.77,1.9 R22.1
N$24
  Top 0.254: R18.1 15.95,28.9 13.68,26.64 U3.19
N$25
  Top 0.254: R18.2 17.6,31.5 10.16,31.5 9.65,32 7.62,32 5.84,30.23 5.84,25.16 D4.A
N$26
  Top 0.254: U3.20 13.05,24.48 11.43,22.86 10.41,22.86 5.59,18.03 5.59,4.06 8.89,0.76 18.29,0.76 19,1.47 R23.1
RF_IOP
  Top 0.254: U1.12 51.85,19.75 L2.2
RFVDD  (via drill 0.36)
  Top 0.254: U1.5 44.25,14.25 v43.45,13.45 L1.1 | U1.13 48.44,20.25 v49.02,20.83 50.19,22 C8.1
  Top 0.406: C9.1 39.4,11.5 L1.1
  Bottom 0.254: v49.02,20.83 48.01,20.83 42.67,15.49 42.67,14.22 v43.45,13.45

### Text on the board
tNames: CCCP | SCL / SDA / +3V / GND / CLK / RX / TX / CS / L1 / L2 | Gnd Dat Clk | SWCLK / GND / SWDIO / RST / SWO | EFR732 | BLE, ZigBee, Thread
bNames: EFR32MG1P732 (v.2) / / 2018-2019 (c) MakBit Software | Made in Russia